# EAGLE design ZX_Gesture_Sensor_SMD (EAGLE 7.7.0)
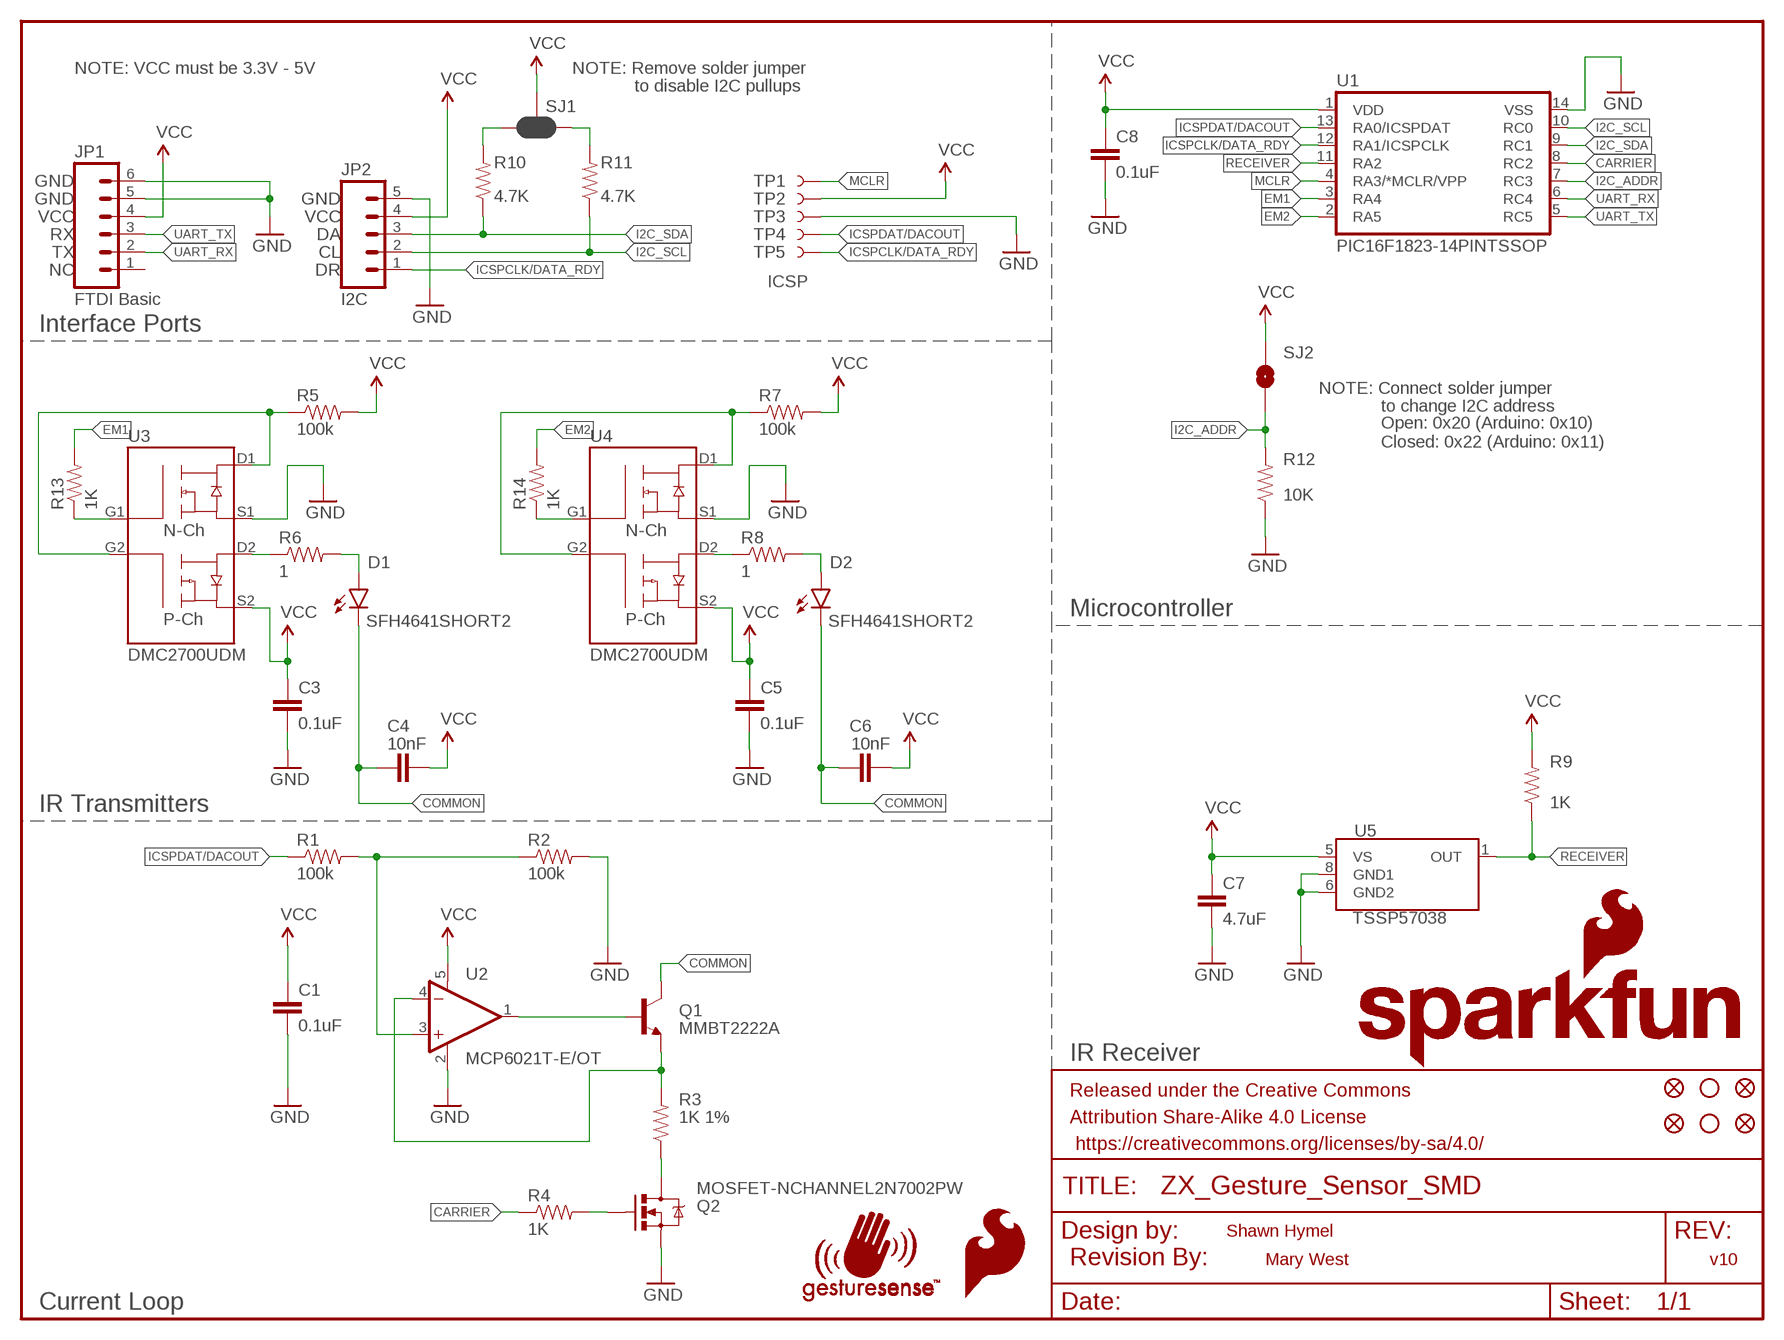
[diagram p0: schematic, sheet 1]

## Parts
C1  0.1uF  0.1UF-25V(+80/-20%)(0603)  [0603-CAP]
C3  0.1uF  0.1UF-25V(+80/-20%)(0603)  [0603-CAP]
C4  10nF  10NF/10000PF-50V-10%(0603)  [0603-CAP]
C5  0.1uF  0.1UF-25V(+80/-20%)(0603)  [0603-CAP]
C6  10nF  10NF/10000PF-50V-10%(0603)  [0603-CAP]
C7  4.7uF  4.7UF-6.3V-10%(0603)0603  [0603-CAP]
C8  0.1uF  0.1UF-25V(+80/-20%)(0603)  [0603-CAP]
D1  SFH4641SHORT2  [SFH4641-SHORT2]
D2  SFH4641SHORT2  [SFH4641-SHORT2]
FID1  FIDUCIALUFIDUCIAL  [MICRO-FIDUCIAL]
FID2  FIDUCIALUFIDUCIAL  [MICRO-FIDUCIAL]
FID3  FIDUCIALUFIDUCIAL  [MICRO-FIDUCIAL]
FID4  FIDUCIALUFIDUCIAL  [MICRO-FIDUCIAL]
FRAME1  FRAME-LETTER  [CREATIVE_COMMONS]
JP1  M06NO_SILK_FEMALE_PTH  [1X06_NO_SILK]
JP2  M05PTH  [1X05]
LOGO1  REVISION  [REVISION]
LOGO2  SFE_LOGO_FLAME.1_INCH  [SFE_LOGO_FLAME_.1]
Q1  MMBT2222A  TRANSISTOR_NPNMMBT2222A  [SOT23-3]
Q2  MOSFET-NCHANNEL2N7002PW  [SOT323]
R1  100k  100KOHM-1/10W-1%(0603)  [0603-RES]
R2  100k  100KOHM-1/10W-1%(0603)  [0603-RES]
R3  1K 1%  1KOHM-1/10W-1%(0603)  [0603-RES]
R4  1K  1KOHM-1/10W-1%(0603)  [0603-RES]
R5  100k  100KOHM-1/10W-1%(0603)  [0603-RES]
R6  1  1OHM1/10W1%(0603)  [0603-RES]
R7  100k  100KOHM-1/10W-1%(0603)  [0603-RES]
R8  1  1OHM1/10W1%(0603)  [0603-RES]
R9  1K  1KOHM-1/10W-1%(0603)  [0603-RES]
R10  4.7K  4.7KOHM-1/10W-1%(0603)  [0603-RES]
R11  4.7K  4.7KOHM-1/10W-1%(0603)  [0603-RES]
R12  10K  10KOHM-1/10W-1%(0603)0603  [0603-RES]
R13  1K  1KOHM-1/10W-1%(0603)  [0603-RES]
R14  1K  1KOHM-1/10W-1%(0603)  [0603-RES]
SJ1  JUMPER-PAD-3-NC_BY_PASTE  [PAD-JUMPER-3-NC_BY_PASTE_YES_SILK_FULL_BOX]
SJ2  JUMPER-PAD-2-NOYES_SILK  [PAD-JUMPER-2-NO_YES_SILK]
STANDOFF1  STAND-OFF  [STAND-OFF]
STANDOFF2  STAND-OFF  [STAND-OFF]
TP1  TEST-POINT3X4  [PAD.03X.04]
TP2  TEST-POINT3X4  [PAD.03X.04]
TP3  TEST-POINT3X4  [PAD.03X.04]
TP4  TEST-POINT3X4  [PAD.03X.04]
TP5  TEST-POINT3X4  [PAD.03X.04]
U1  PIC16F1823-14PINTSSOP  [TSSOP14]
U2  MCP6021T-E/OT  [SOT23-5]
U3  DMC2700UDM  [SOT26]
U4  DMC2700UDM  [SOT26]
U5  TSSP57038  [TSOP572]
U$5  SFE_LOGO_NAME_FLAME.1_INCH  [SFE_LOGO_NAME_FLAME_.1]
U$6  GESTURESENSE_LOGOSTEXT  [GESTURESENSE_TEXT]

## Nets
CARRIER: R4.1 U1.8(RC2)
COMMON: C4.1 C6.1 D1.C D2.C Q1.3(C)
EM1: R13.2 U1.3(RA4)
EM2: R14.2 U1.2(RA5)
GND: C1.2 C3.2 C5.2 C7.2 C8.2 JP1.5 JP1.6 JP2.5 Q2.2(S) R2.2 R12.1 TP3.P$1 U1.14(VSS) U2.2(V-) U3.S1 U4.S1 U5.6(GND2) U5.8(GND1)
I2C_ADDR: R12.2 SJ2.1 U1.7(RC3)
I2C_SCL: JP2.2 R11.1 U1.10(RC0)
I2C_SDA: JP2.3 R10.1 U1.9(RC1)
ICSPCLK/DATA_RDY: JP2.1 TP5.P$1 U1.12(RA1/ICSPCLK)
ICSPDAT/DACOUT: R1.1 TP4.P$1 U1.13(RA0/ICSPDAT)
MCLR: TP1.P$1 U1.4(RA3/*MCLR/VPP)
N$1: R1.2 R2.1 U2.3(+IN)
N$2: Q1.2(E) R3.2 U2.4(-IN)
N$3: Q1.1(B) U2.1(OUT)
N$4: Q2.3(D) R3.1
N$5: Q2.1(G) R4.2
N$6: R6.1 U3.D2
N$7: D1.A R6.2
N$8: R5.1 U3.D1 U3.G2
N$9: R7.1 U4.D1 U4.G2
N$10: R10.2 SJ1.3
N$11: R8.1 U4.D2
N$12: D2.A R8.2
N$13: R11.2 SJ1.1
N$15: R13.1 U3.G1
N$19: R14.1 U4.G1
RECEIVER: R9.1 U1.11(RA2) U5.1(OUT)
UART_RX: JP1.2 U1.6(RC4)
UART_TX: JP1.3 U1.5(RC5)
VCC: C1.1 C3.1 C4.2 C5.1 C6.2 C7.1 C8.1 JP1.4 JP2.4 R5.2 R7.2 R9.2 SJ1.2 SJ2.2 TP2.P$1 U1.1(VDD) U2.5(V+) U3.S2 U4.S2 U5.5(VS)
Unconnected: JP1.1

## Notes on the sheet
- NOTE: VCC must be 3.3V - 5V | NOTE: Remove solder jumper
- to disable I2C pullups
- GND
- GND | GND
- VCC | VCC
- RX | DA
- TX | CL
- NC | DR
- ICSP
- FTDI Basic | I2C
- Interface Ports
- NOTE: Connect solder jumper
- to change I2C address
- Open: 0x20 (Arduino: 0x10)
  Closed: 0x22 (Arduino: 0x11)
- Microcontroller
- IR Transmitters
- IR Receiver
- Shawn Hymel
- Mary West | v10
- Current Loop

## Library data of the parts
C1 C3 C5 C8 = SparkFun-Capacitors:0.1UF-25V(+80/-20%)(0603): CAP-00810 Ceramic Standard decoupling cap; PROD_ID: CAP-00810
C4 C6 = SparkFun-Capacitors:10NF/10000PF-50V-10%(0603): CAP-00867; PROD_ID: CAP-00867
C7 = SparkFun-Capacitors:4.7UF-6.3V-10%(0603): CAP-08280; PROD_ID: CAP-08280
D1 D2 = SparkFun-LED:SFH4641; PROD_ID: DIO-11994
FID1-FID4 = SparkFun-Aesthetics:FIDUCIAL: Fiducial Alignment Points Various fiducial points for machine vision alignment.
FRAME1 = SparkFun-Aesthetics:FRAME-LETTER: Schematic Frame Standard 8.5x11 US Letter frame
JP1 = SparkFun-Connectors:M06: Header 6 Standard 6-pin 0.1" header. Use with straight break away headers (SKU : PRT-00116), right angle break away headers (PRT-00553), swiss pins (PRT-00743), machine pins (PRT-00117), and female headers (PRT-00115). Molex polarized connector foot print use with SKU : PRT-08094 with associated crimp pins and housings. NOTES ON THE VARIANTS LOCK and LOCK_LONGPADS... This footprint was designed to help hold the alignment of a through-hole component (i.e. 6-pin header) while soldering it into place. You may notice that each hole has been shifted either up or down by 0.005 of an inch from it's more standard position (which is a perfectly straight line). This slight alteration caused the pins (the squares in the middle) to touch the edges of the holes. Because they are alternating, it causes a "brace" to hold the component in place. 0.005 has proven to be the perfect amount of "off-center" position when using our standard breakaway headers. Although looks a little odd when you look at the bare footprint, once you have a header in there, the alteration is very hard to notice. Also,if you push a header all the way into place, it is covered up entirely on the bottom side. This idea of altering the position of holes to aid alignment will be further integrated into the Sparkfun Library for other footprints. It can help hold any component with 3 or more connection pins.; PROD_ID: CONN-08437
JP2 = SparkFun-Connectors:M05: Header 5 Standard 5-pin 0.1" header. Use with straight break away headers (SKU : PRT-00116), right angle break away headers (PRT-00553), swiss pins (PRT-00743), machine pins (PRT-00117), and female headers (PRT-00115). Molex polarized connector foot print use with SKU : PRT-08230 with associated crimp pins and housings.
LOGO1 = SparkFun-Aesthetics:REVISION
LOGO2 = SparkFun-Aesthetics:SFE_LOGO_FLAME: SFE Logo, flame only This is the SparkFun flame logo. The logo on the schematic will always be the same size; the package variant is the height of the flame. Default layer for the logo on the board is tSilk.
Q1 = SparkFun-DiscreteSemi:TRANSISTOR_NPN: Generic NPN BJT MMBT2222A - TRANS-08049 (SOT-23, 1A 40V) MPSA42 - TRANS-09116 (SOT-23, 500mA 300V) MMBT5088LT1G - TRANS-11160 (SOT-23, 50 mA 30V) BC547 - COM-08928 <http://www.sparkfun.com/products/8928> (TO-92 45V 100mA) (1.Collector 2.Base 3.Emitter) 2N3904 - COM-00521 <http://www.sparkfun.com/products/521> (TO-92 40V 200mA) (1.Emitter 2.Base 3.Collector) P2N2222A - COM-12852 <http://www.sparkfun.com/products/12852> (TO-92 40V 600mA) (1.Collector 2.Base 3.Emitter); PROD_ID: TRANS-08049
Q2 = SparkFun-DiscreteSemi:MOSFET-NCHANNEL: Common NMOSFET Parts MFG P/N Store ID Prod ID FDD8780 TRANS-09984 SI7820DN TRANS-11055 FDS6630A IC-08089 2N7002PW TRANS-11151 FQP30N06L COM-10213 TRANS-10060 BSS123LT1G TRANS-08345 BSS138 TRANS-00830 BS170 2N7000; PROD_ID: TRANS-11151
R1 R2 R5 R7 = SparkFun-Resistors:100KOHM-1/10W-1%(0603): RES-07828; PROD_ID: RES-07828
R3 = SparkFun-Resistors:1KOHM-1/10W-1%(0603): RES-07856; PROD_ID: RES-07856; VALUE: 1K
R4 R9 R13 R14 = SparkFun-Resistors:1KOHM-1/10W-1%(0603): RES-07856; PROD_ID: RES-07856
R6 R8 = SparkFun-Resistors:1OHM1/10W1%(0603): RES-08269; PROD_ID: RES-08269
R10 R11 = SparkFun-Resistors:4.7KOHM-1/10W-1%(0603): RES-07857; PROD_ID: RES-07857
R12 = SparkFun-Resistors:10KOHM-1/10W-1%(0603): RES-00824; PROD_ID: RES-00824
SJ1 = SparkFun-Passives:JUMPER-PAD-3-NC_BY_PASTE
SJ2 = SparkFun-Passives:JUMPER-PAD-2-NO
STANDOFF1 STANDOFF2 = SparkFun-Electromechanical:STAND-OFF: #4 Stand Off This is the mechanical footprint for a #4 phillips button head screw. Use the keepout ring to avoid running the screw head into surrounding components. SKU : PRT-00447
TP1-TP5 = SparkFun-Passives:TEST-POINT: Bare copper test points for troubleshooting or ICT
U1 = SparkFun-DigitalIC:PIC16F1823-14PIN; PROD_ID: IC-11992
U2 = SparkFun-AnalogIC:MCP6021: Rail-to-rail input/output op-amp with 10 MHz bandwidth.; PROD_ID: IC-12504
U3 U4 = SparkFun-DiscreteSemi:DMC2700UDM; PROD_ID: TRANS-11993
U5 = SparkFun-Sensors:TSSP57038; PROD_ID: PROD-13609
U$5 = SparkFun-Aesthetics:SFE_LOGO_NAME_FLAME: SFE Logo, name and flame This is the SparkFun full logo. The logo on the schematic will always be the same size; the package variant is the height of the flame part of the logo. Default layer for the logo on the board is tSilk.
U$6 = SparkFun-Aesthetics:GESTURESENSE_LOGOS

## Board
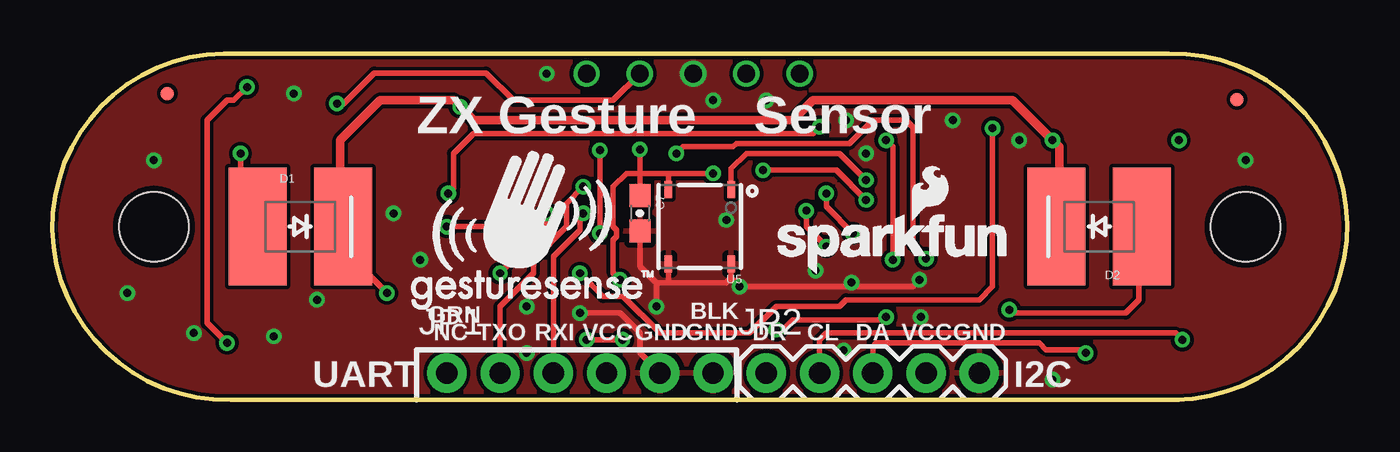
[diagram p1: board, top side]
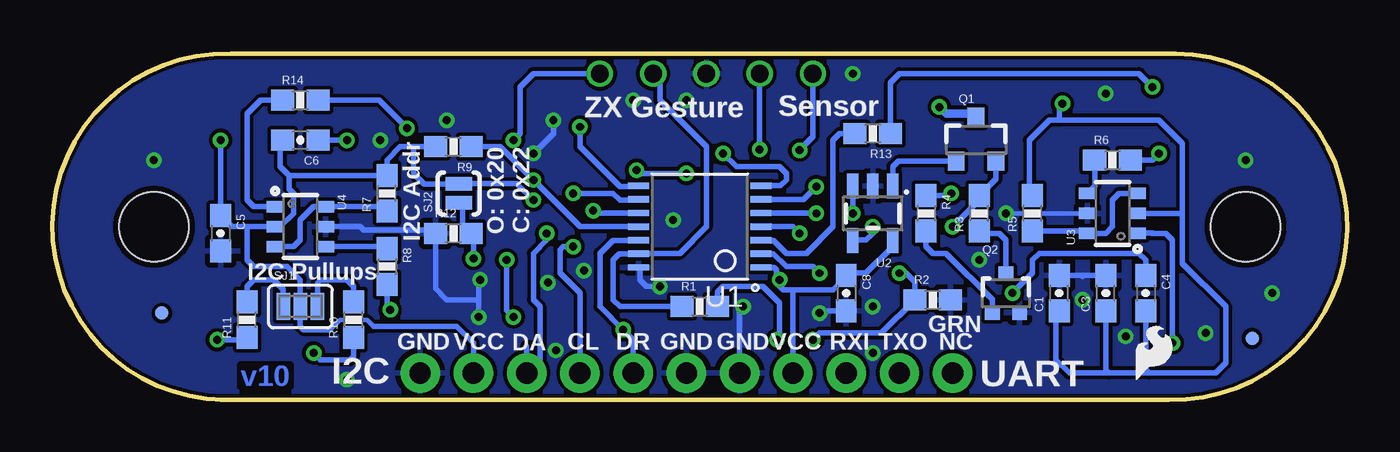
[diagram p2: board, bottom side, seen from below]

Size 61.75 x 16.51 mm. Coordinates in mm from the lower left corner, seen from the top.
Outline: 53.58,0 8.49,0 arc-181 8.18,16.51 53.26,16.51 arc-181 53.58,0
Outline: 53.58,0 53.74,0
Copper layers (1*16): Top 0.035mm / dielectric 1.5mm / Bottom 0.035mm
Design rules "SparkFun-2-layer-TIGHT": minimum track width 7mil, minimum drill 15mil, track to track 7mil, track to pad 7mil, pad to pad 7mil, via to via 7mil, smd to smd 7mil, copper to edge 7mil, drill to drill 7mil, minimum pad ring 7mil, minimum via ring 7mil, stop-mask expansion 4mil, vias tented up to drill 20mil, thermal gap 10mil

### Footprints (pad centres in the part's own frame; a part is rotated, then mirrored left to right if it is on the bottom)
0603-CAP = smd 1.1 x 1: 1 -0.85,0; 2 0.85,0
SFH4641-SHORT2 = smd 5.62 x 2.77: A 0,-2.035; C 0,2.035
MICRO-FIDUCIAL = smd 0.635 x 0.635: 1 0,0
1X06_NO_SILK = drill 1.016 pad 1.88: 1 0,0; 2 2.54,0; 3 5.08,0; 4 7.62,0; 5 10.16,0; 6 12.7,0
1X05 = drill 1.016 pad 1.88: 1 0,0; 2 2.54,0; 3 5.08,0; 4 7.62,0; 5 10.16,0
SOT23-3 = smd 0.8 x 0.9: 1 -0.95,-1; 2 0.95,-1; 3 0,1.1
SOT323 = smd 0.7 x 0.7: 1 -0.65,-0.925; 2 0.65,-0.925; 3 0,0.925
0603-RES = smd 1.1 x 1: 1 -0.85,0; 2 0.85,0
PAD-JUMPER-3-NC_BY_PASTE_YES_SILK_FULL_BOX = smd 0.635 x 1.27: 1 -0.813,0; 2 0,0; 3 0.813,0
PAD-JUMPER-2-NO_YES_SILK = smd 0.635 x 1.27: 1 -0.45,0; 2 0.45,0
STAND-OFF = hole 3.302: 0,0
PAD.03X.04 = smd 1.016 x 1.016: P$1 0,0
TSSOP14 = smd 0.305 x 0.991: 1 -1.95,-2.918; 2 -1.3,-2.918; 3 -0.65,-2.918; 4 0,-2.918; 5 0.65,-2.918; 6 1.3,-2.918; 7 1.95,-2.918; 8 1.95,2.918; 9 1.3,2.918; 10 0.65,2.918; 11 0,2.918; 12 -0.65,2.918; 13 -1.3,2.918; 14 -1.95,2.918
SOT23-5 = smd 0.55 x 1.2: 1 -0.95,-1.3; 2 0,-1.3; 3 0.95,-1.3; 4 0.95,1.3; 5 -0.95,1.3
SOT26 = smd 0.55 x 0.8: D1 -0.95,1.2; D2 0.95,1.2; G1 -0.95,-1.2; G2 0.95,-1.2; S1 0,1.2; S2 0,-1.2
TSOP572 = smd 0.35 x 0.8: 1 -1.5,-1.775; 5 1.5,-1.775; 6 1.5,1.775; 8 -1.5,1.775

### Placement (x,y rotation side)
C1  13.73,5.08 90 bottom
C3  11.51,5.08 90 bottom
C4  9.6,5.08 270 bottom
C5  53.74,7.94 270 bottom
C6  49.93,12.38 180 bottom
C7  28.02,8.89 270 top
C8  23.89,5.08 270 bottom
D1  11.83,8.26 270 top
D2  49.93,8.26 90 top
FID1  4.52,2.92 0 bottom
FID2  56.53,4.13 0 bottom
FID3  5.48,14.61 0 top
FID4  56.5,14.32 0 top
FRAME1  -4.37,-8.57 0 top  (outside the outline)
JP1  18.81,1.27 0 top
JP2  34.05,1.27 0 top
LOGO1  26.75,-13.65 180 top  (outside the outline)
LOGO2  10.37,0.61 0 bottom
Q1  17.7,12.38 0 bottom
Q2  16.27,5.08 0 bottom
R1  30.88,4.45 0 bottom
R2  19.76,4.76 0 bottom
R3  17.54,8.89 90 bottom
R4  20.08,8.89 270 bottom
R5  15,8.89 90 bottom
R6  11.19,11.43 0 bottom
R7  45.8,9.84 90 bottom
R8  45.8,6.35 270 bottom
R9  42.62,12.06 180 bottom
R10  47.39,3.81 90 bottom
R11  52.47,3.81 90 bottom
R12  42.62,7.94 0 bottom
R13  22.62,12.7 180 bottom
R14  49.93,14.29 0 bottom
SJ1  49.93,4.45 0 bottom
SJ2  42.37,9.84 90 bottom
STANDOFF1  4.84,8.26 0 top
STANDOFF2  56.91,8.26 90 top
TP1  25.48,15.56 0 bottom
TP2  28.02,15.56 90 bottom
TP3  30.56,15.56 0 bottom
TP4  33.1,15.56 0 bottom
TP5  35.64,15.56 0 bottom
U1  30.88,8.26 90 bottom
U2  22.62,8.89 180 bottom
U3  11.19,8.89 90 bottom
U4  49.93,8.26 270 bottom
U5  30.88,8.26 180 top
U$5  34.16,5.93 0 top
U$6  17.13,4.32 0 top

### Tracks (layer width: path | path; a pad name or v marks a point on that pad's centre or on a via)
CARRIER  (via drill 0.38)
  Top 0.254: v36.59,13.02 36.27,12.7 20.08,12.7 19.13,11.75 19.13,10.1 v18.88,9.84
  Bottom 0.254: R4.1 18.98,9.74 v18.88,9.84 | U1.8 33.84,10.16 34.69,10.16 36.59,12.06 v36.59,13.02
COMMON  (via drill 0.38)
  Top 0.254: v15.95,5.08 13.73,7.3 13.73,8.26 D1.C | 48.02,8.26 D2.C
  Top 0.406: 48.02,8.26 48.02,12.06 v47.7,12.38 45.8,14.29 36.27,14.29 35.32,13.34 20.08,13.34 v19.45,13.97 19.13,14.29 15.64,14.29 13.73,12.38 13.73,8.26
  Bottom 0.254: C4.1 9.6,6.67 9.92,6.99 14.68,6.99 15,6.67 15,6.03 v15.95,5.08 | v47.7,12.38 C6.1
  Bottom 0.406: 17.86,13.64 19.12,13.64 v19.45,13.97
  Bottom 0.508: 17.86,13.64 Q1.3
EM1
  Bottom 0.254: R13.2 24.21,12.7 24.53,12.38 24.53,8.26 25.8,6.99 26.75,6.99 27.37,7.61 U1.3 27.94,7.62
EM2  (via drill 0.38)
  Top 0.254: v44.85,12.95 44.85,5.4 44.21,4.76 37.86,4.76 37.54,4.45 34.53,4.45 33.26,3.17 28.97,3.17 27.23,4.92 26.27,4.92 v25.16,6.03
  Bottom 0.254: U1.2 27.35,6.96 26.75,6.35 25.48,6.35 v25.16,6.03 | R14.2 46.18,14.29 v44.85,12.95
GND  (via drill 0.38, 0.84)
  Top 0.254: U5.8 32.38,5.8 | 32.38,5.8 v32.78,5.4 41.04,5.4 v41.35,5.71 | C7.2 28.02,6.35 28.81,5.56 | 28.81,5.56 29.45,5.56 | 29.45,5.56 32.13,5.56 32.38,5.8 | U5.6 29.38,5.63 29.45,5.56 | 28.81,5.56 v28.81,4.45 | v25.16,4.13 27.07,4.13 28.02,3.17 28.02,2.22 JP1.5
  Bottom 0.203: U3.S1 v16.27,8.89
  Bottom 0.254: C1.2 C3.2 12.56,5.93 12.62,5.87 | v32.78,5.4 33.42,5.4 33.73,5.71 33.73,6.25 U1.14 | U4.S1 47.07,8.26 46.91,8.1 43.63,8.1 R12.1 43.47,5.29 42.94,4.76 41.42,4.76 | 23.89,4.13 C8.2 25.06,4.23 v25.16,4.13 | v41.35,5.71 41.42,5.65 41.42,4.76 | v37.86,13.34 37.86,12.7 v38.81,11.75 | 41.42,4.76 v41.42,3.94 | JP1.5 28.97,4.29 v28.81,4.45
  other vias: 10.56,3.02 30.56,15.56 11.51,14.61 4.84,11.43 3.57,5.08 12.62,4.76 56.91,11.43 47.7,0.95 6.75,3.17 23.57,15.56 31.51,14.29 34.05,14.29 36.4,6.16 17.54,6.67 42.94,13.34 32.15,8.57 46.12,12.38 38.12,5.59 37.73,2.35 22.62,4.45 22.62,2.22
  pour Top: 0.24,3.81 4.84,0 56.91,0 61.99,3.81 61.99,12.7 56.91,16.51 4.84,16.51 0.24,12.7
  pour Bottom: 0.24,3.97 0.24,12.86 4.84,16.51 56.91,16.51 61.99,13.02 61.99,4.13 56.91,0 4.84,0
I2C_ADDR  (via drill 0.38)
  Top 0.254: v29.77,11.75 30.08,12.06 32.46,12.06 32.62,12.22 38.02,12.22 39.13,13.34 40.72,13.34 41.04,13.02 41.04,7.37 v41.67,6.73
  Bottom 0.254: U1.7 27.02,10.21 26.75,10.48 26.75,10.79 27.07,11.11 29.13,11.11 v29.77,11.75 | SJ2.1 42.18,9.21 42.18,8.35 R12.2 41.67,7.83 v41.67,6.73
I2C_SCL  (via drill 0.38)
  Top 0.254: JP2.2 36.59,2.86 36.91,3.17 53.58,3.17 v53.9,2.86 | v35.96,9.02 35.96,8.26 v36.91,7.3
  Bottom 0.254: v53.9,2.86 52.57,2.86 R11.1 | v36.91,7.3 37.39,7.3 37.54,7.14 37.54,6.03 36.59,5.08 JP2.2 36.59,2.22 | U1.10 35.84,8.9 v35.96,9.02
I2C_SDA  (via drill 0.38)
  Top 0.254: v36.91,9.84 36.91,9.21 v38.18,7.94 | JP2.3 39.13,2.54 39.29,2.7 47.07,2.7 47.39,2.38 49.13,2.38 v49.29,2.22
  Bottom 0.254: JP2.3 39.13,2.54 | R10.1 47.39,2.06 47.55,1.91 48.97,1.91 v49.29,2.22 | v36.91,9.84 35,9.84 34.69,9.53 33.82,9.53 U1.9 | v38.18,7.94 38.18,7.62 38.81,6.99 38.81,4.76 38.5,4.45 38.5,1.91 JP2.3 | 38.81,1.59 JP2.3
ICSPCLK/DATA_RDY  (via drill 0.38, 0.84)
  Top 0.254: v34.53,3.33 34.85,3.33 35.32,3.81 39.64,3.81 v39.77,3.94 | v39.77,12.38 40.08,12.06 v40.08,6.67
  Bottom 0.254: JP2.1 34.05,2.86 v34.53,3.33 35.64,4.45 35.64,6.99 35.02,7.61 U1.12 | TP5.P$1 38.81,15.56 39.45,14.92 39.45,12.7 v39.77,12.38 | v40.08,6.67 40.08,4.25 v39.77,3.94
  other vias: 35.64,15.56
ICSPDAT/DACOUT  (via drill 0.84)
  Bottom 0.254: R1.1 34.69,4.45 35,4.76 35,6.67 34.72,6.96 U1.13 33.76,6.99 31.83,6.99 30.56,8.26 30.56,12.06 32.78,14.29 32.78,15.24 TP4.P$1
  other vias: 33.1,15.56
MCLR  (via drill 0.38, 0.84)
  Top 0.254: 26.27,8.1 v26.11,7.94 v26.11,11.91
  Bottom 0.254: U1.4 26.43,8.26 v26.11,7.94 | TP1.P$1 25.48,12.54 v26.11,11.91
  other vias: 25.48,15.56
N$1  (via drill 0.38)
  Top 0.254: v23.57,8.89 23.57,8.26 v21.35,6.03 | v27.19,2.86 v25.48,2.86
  Bottom 0.254: v25.48,2.86 25.16,3.17 22.2,3.17 R2.1 20.61,5.61 21.03,6.03 v21.35,6.03 | R1.2 30.03,5.14 29.77,5.4 27.86,5.4 27.07,4.6 27.07,2.98 v27.19,2.86 | U2.3 v23.57,8.89
N$2  (via drill 0.38)
  Top 0.254: v22.62,8.26 v18.81,8.26
  Bottom 0.254: v18.81,8.26 17.54,9.53 R3.2 16.75,10.53 Q1.2 | v22.62,8.26 22.62,7.94 22.94,7.62 23.54,7.62 U2.4
N$3
  Bottom 0.254: Q1.1 21.4,11.38 21.67,11.11 U2.1
N$4
  Bottom 0.254: Q2.3 16.27,7.62 16.59,7.94 17.44,7.94 R3.1
N$5
  Bottom 0.254: Q2.1 16.92,4.78 19.13,6.99 19.76,6.99 20.08,7.3 R4.2
N$6
  Bottom 0.254: R6.1 12.04,10.19 U3.D2
N$7  (via drill 0.38)
  Top 0.254: 9.92,8.89 9.92,8.26 D1.A | 9.92,8.89 9.92,10.79 | v8.97,11.75 8.97,9.21 9.29,8.89 9.92,8.89
  Bottom 0.254: R6.2 9.29,11.43 v8.97,11.75
N$8
  Bottom 0.254: U3.G2 10.88,9.84 11.19,9.53 11.19,8.26 11.51,7.94 U3.D1 12.49,8.04 R5.1
N$9
  Bottom 0.254: U4.G2 50.24,7.3 49.93,7.62 49.93,8.57 49.29,9.21 U4.D1 46.01,9.21 R7.1
N$10
  Bottom 0.254: SJ1.3 49.11,5.58 48.97,5.71 47.7,5.71 47.39,5.4 R10.2
N$11
  Bottom 0.254: U4.D2 45.9,7.3 R8.1
N$12  (via drill 0.38)
  Top 0.254: D2.A 51.83,8.26 51.83,4.76 51.2,4.13 45.8,4.13 v45.64,4.29
  Bottom 0.254: R8.2 45.8,4.45 v45.64,4.29
N$13
  Bottom 0.254: SJ1.1 50.74,5.26 51.2,5.71 52.15,5.71 52.47,5.4 R11.2
N$15  (via drill 0.38)
  Top 0.254: v9.29,14.92 8.65,14.29 8.33,14.29 7.38,13.34 7.38,3.65 v8.33,2.7
  Bottom 0.254: R13.1 21.77,15.14 21.35,15.56 9.92,15.56 v9.29,14.92 | U3.G1 9.29,7.94 8.65,7.94 8.33,7.62 v8.33,2.7
N$19
  Bottom 0.254: R14.1 51.83,14.29 52.47,13.65 52.47,9.53 52.15,9.21 U4.G1
RECEIVER  (via drill 0.38)
  Top 0.254: U5.1 32.38,11.03 33.1,11.75 37.54,11.75 v38.81,10.48
  Bottom 0.254: U1.11 36.59,8.26 v38.81,10.48 40.4,12.06 R9.1
UART_RX  (via drill 0.38)
  Top 0.254: v25.32,10.16 24.53,9.37 24.53,8.26 22.94,6.67 22.94,6.03 21.35,4.45 JP1.2
  Bottom 0.254: U1.6 25.93,9.55 v25.32,10.16
UART_TX  (via drill 0.38)
  Top 0.254: JP1.3 23.89,6.83 25.16,8.1 25.16,8.73 v25.32,8.89
  Bottom 0.254: U1.5 25.34,8.9 v25.32,8.89
VCC  (via drill 0.38, 0.84)
  Top 0.254: 28.02,9.84 C7.1 | 28.31,10.03 C7.1 | 29.45,10.79 v31.51,10.79 | U5.5 29.38,10.72 29.45,10.79 | v27.07,5.71 26.75,6.03 26.75,7.62 26.91,7.78 26.91,8.1 26.75,8.26 26.75,10.16 27.38,10.79 28.02,10.79 | 28.02,10.79 29.45,10.79 | C7.1 28.02,10.79 | v28.02,11.94 28.02,10.79 | v33.89,10.95 37.39,10.95 v38.81,9.53 | v13.57,14.13 13.89,14.13 15.35,15.59 20.68,15.59 21.99,14.29 26.75,14.29 TP2.P$1
  Bottom 0.203: 46.43,3.49 46.75,3.81 48.02,3.81 48.5,3.33
  Bottom 0.254: U2.5 21.67,7.3 22.94,6.03 23.79,6.03 C8.1 23.89,5.87 24.53,5.24 26.43,5.24 | 10.24,8.89 U3.S2 7.86,8.89 | 50.46,10.69 R7.2 45.8,11.43 45.16,12.06 44.53,12.06 | C6.2 50.88,12.28 50.88,11.11 50.46,10.69 | v38.81,9.53 39.61,10.32 42.31,10.32 42.33,10.29 SJ2.2 44.03,10.29 44.53,10.79 44.53,12.06 | v31.51,10.79 33.73,10.79 v33.89,10.95 | JP2.4 41.67,2.7 42.47,3.49 46.43,3.49 | 48.5,3.33 49.77,3.33 49.93,3.49 SJ1.2 49.93,5.71 50.56,6.35 52.15,6.35 52.47,6.67 52.47,8.26 | 26.43,5.24 26.89,5.24 27.23,5.57 27.23,5.71 | JP1.4 26.43,5.24 | U1.1 27.34,6.3 27.23,6.19 27.23,5.71 | 9.45,1.27 11.35,1.27 | 11.35,1.27 13.26,1.27 13.89,1.91 13.89,4.07 C1.1 | C3.1 11.51,1.43 11.35,1.27 | C4.2 9.6,1.43 9.45,1.27 | 27.23,5.71 v27.07,5.71 | R5.2 15.16,9.9 15.16,12.38 14.21,13.34 13.73,13.34 | 9.45,1.27 6.27,1.27 5.79,1.75 5.79,4.45 7.86,6.51 7.86,8.89 | 7.86,8.89 7.86,12.22 8.97,13.34 13.73,13.34 | 13.73,14.13 v13.57,14.13 13.73,13.97 13.73,13.34 | R9.2 44.53,12.06 | v53.74,12.38 C5.1 53.2,8.26 52.47,8.26 | 52.47,8.26 U4.S2 50.88,8.26 50.24,8.89 50.24,9.84 50.46,10.06 50.46,10.69 | TP2.P$1 v28.02,11.94
  other vias: 28.02,15.56

### Text on the board
Bottom: v10
tPlace: ZX Gesture | Sensor | GRN | BLK | NC | TXO | RXI | VCC | GND | GND | DR | CL | DA | VCC | GND | UART | I2C
bPlace: Sensor | ZX Gesture | O: 0x20 / C: 0x22 | I2C Addr | I2C Pullups | GRN | NC | TXO | RXI | VCC | GND | GND | DR | CL | DA | VCC | GND | UART | I2C
Measures: All Units Inches
tDocu: Shawn Hymel (SparkFun Electronics) / with XYZ Interactive Technologies | Mary West